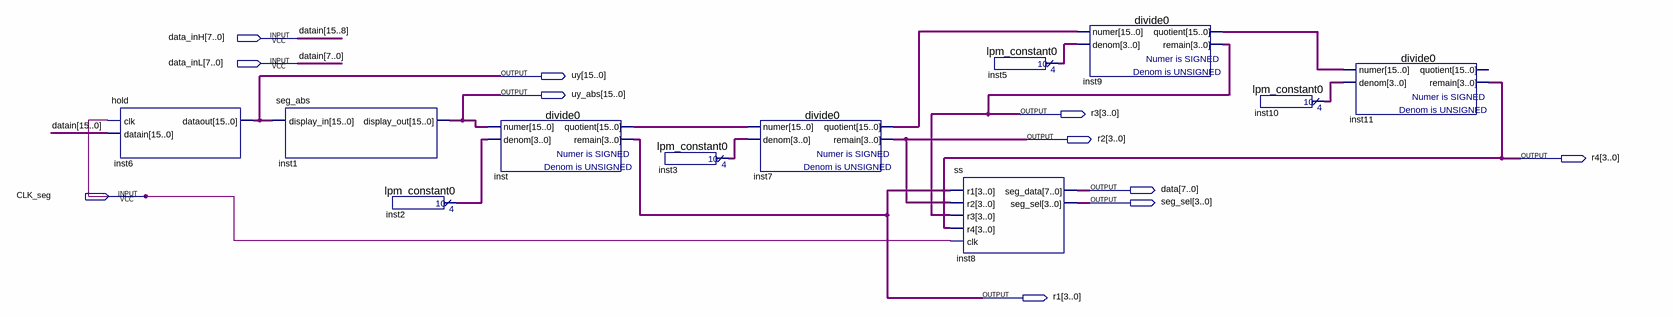
[diagram p0: schematic sheet]
// Quartus schematic seg.bdf as structural Verilog: 11 symbols, 11 pins
module seg (
  input  [7:0] data_inH,
  input  [7:0] data_inL,
  input  CLK_seg,
  output [15:0] uy,
  output [15:0] uy_abs,
  output [3:0] r3,
  output [3:0] r2,
  output [3:0] r4,
  output [7:0] data,
  output [3:0] seg_sel,
  output [3:0] r1
);

  wire [3:0] inst2_result, inst3_result, inst5_result, inst10_result;
  wire [15:0] inst7_quotient, inst9_quotient, inst_quotient;

  hold inst6 (.clk(CLK_seg), .datain({data_inH, data_inL}), .dataout(uy));
  seg_abs inst1 (.display_in(uy), .display_out(uy_abs));
  lpm_constant0 inst2 (.result(inst2_result));
  divide0 inst (.numer(uy_abs), .denom(inst2_result), .quotient(inst_quotient), .remain(r1));
  lpm_constant0 inst3 (.result(inst3_result));
  divide0 inst7 (.numer(inst_quotient), .denom(inst3_result), .quotient(inst7_quotient), .remain(r2));
  ss inst8 (.r1(r1), .r2(r2), .r3(r3), .r4(r4), .clk(CLK_seg), .seg_data(data), .seg_sel(seg_sel));
  lpm_constant0 inst5 (.result(inst5_result));
  divide0 inst9 (.numer(inst7_quotient), .denom(inst5_result), .quotient(inst9_quotient), .remain(r3));
  lpm_constant0 inst10 (.result(inst10_result));
  divide0 inst11 (.numer(inst9_quotient), .denom(inst10_result), .remain(r4));  // open: quotient

  // Other names for the same wires on the sheet: datain[15:0] = {data_inH, data_inL}
endmodule
